# Altium project Double_H_Bridge_v1.0.PrjPCB
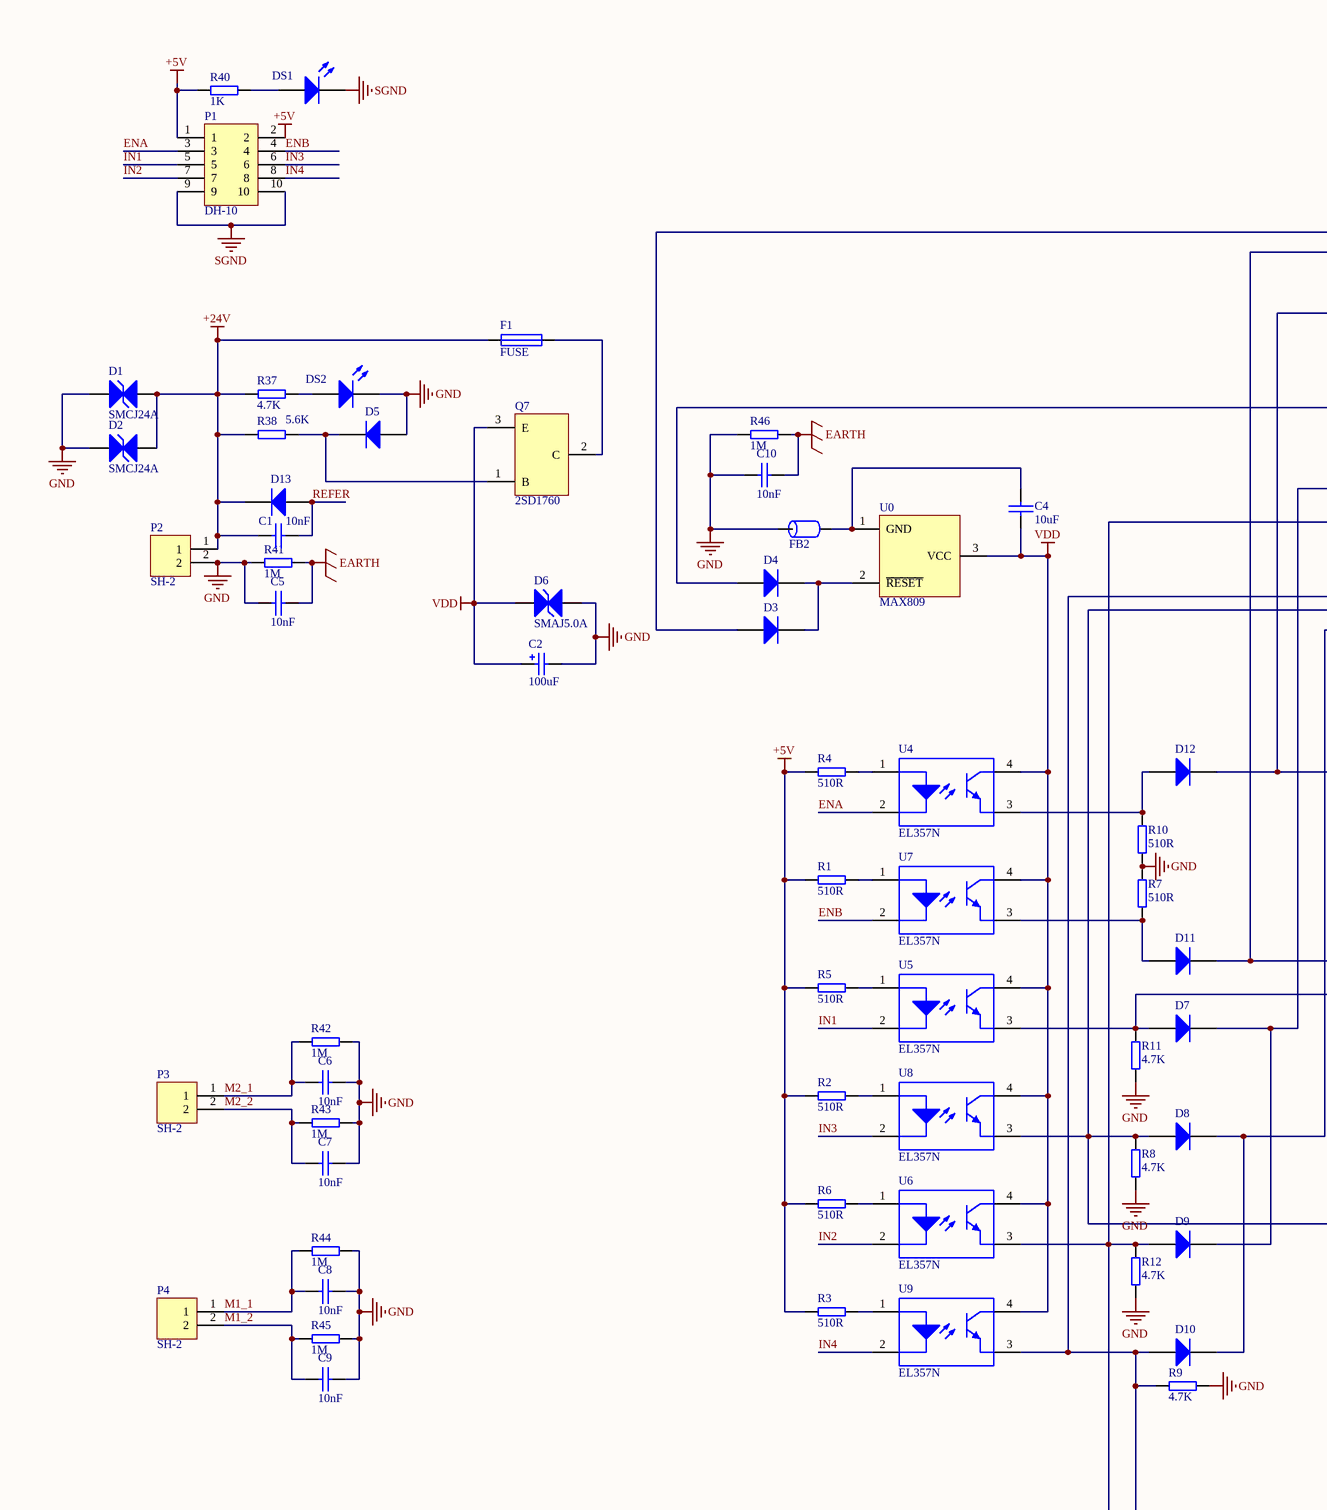
[diagram p0: Double_H_Bridge_v1.0.SchDoc, left]
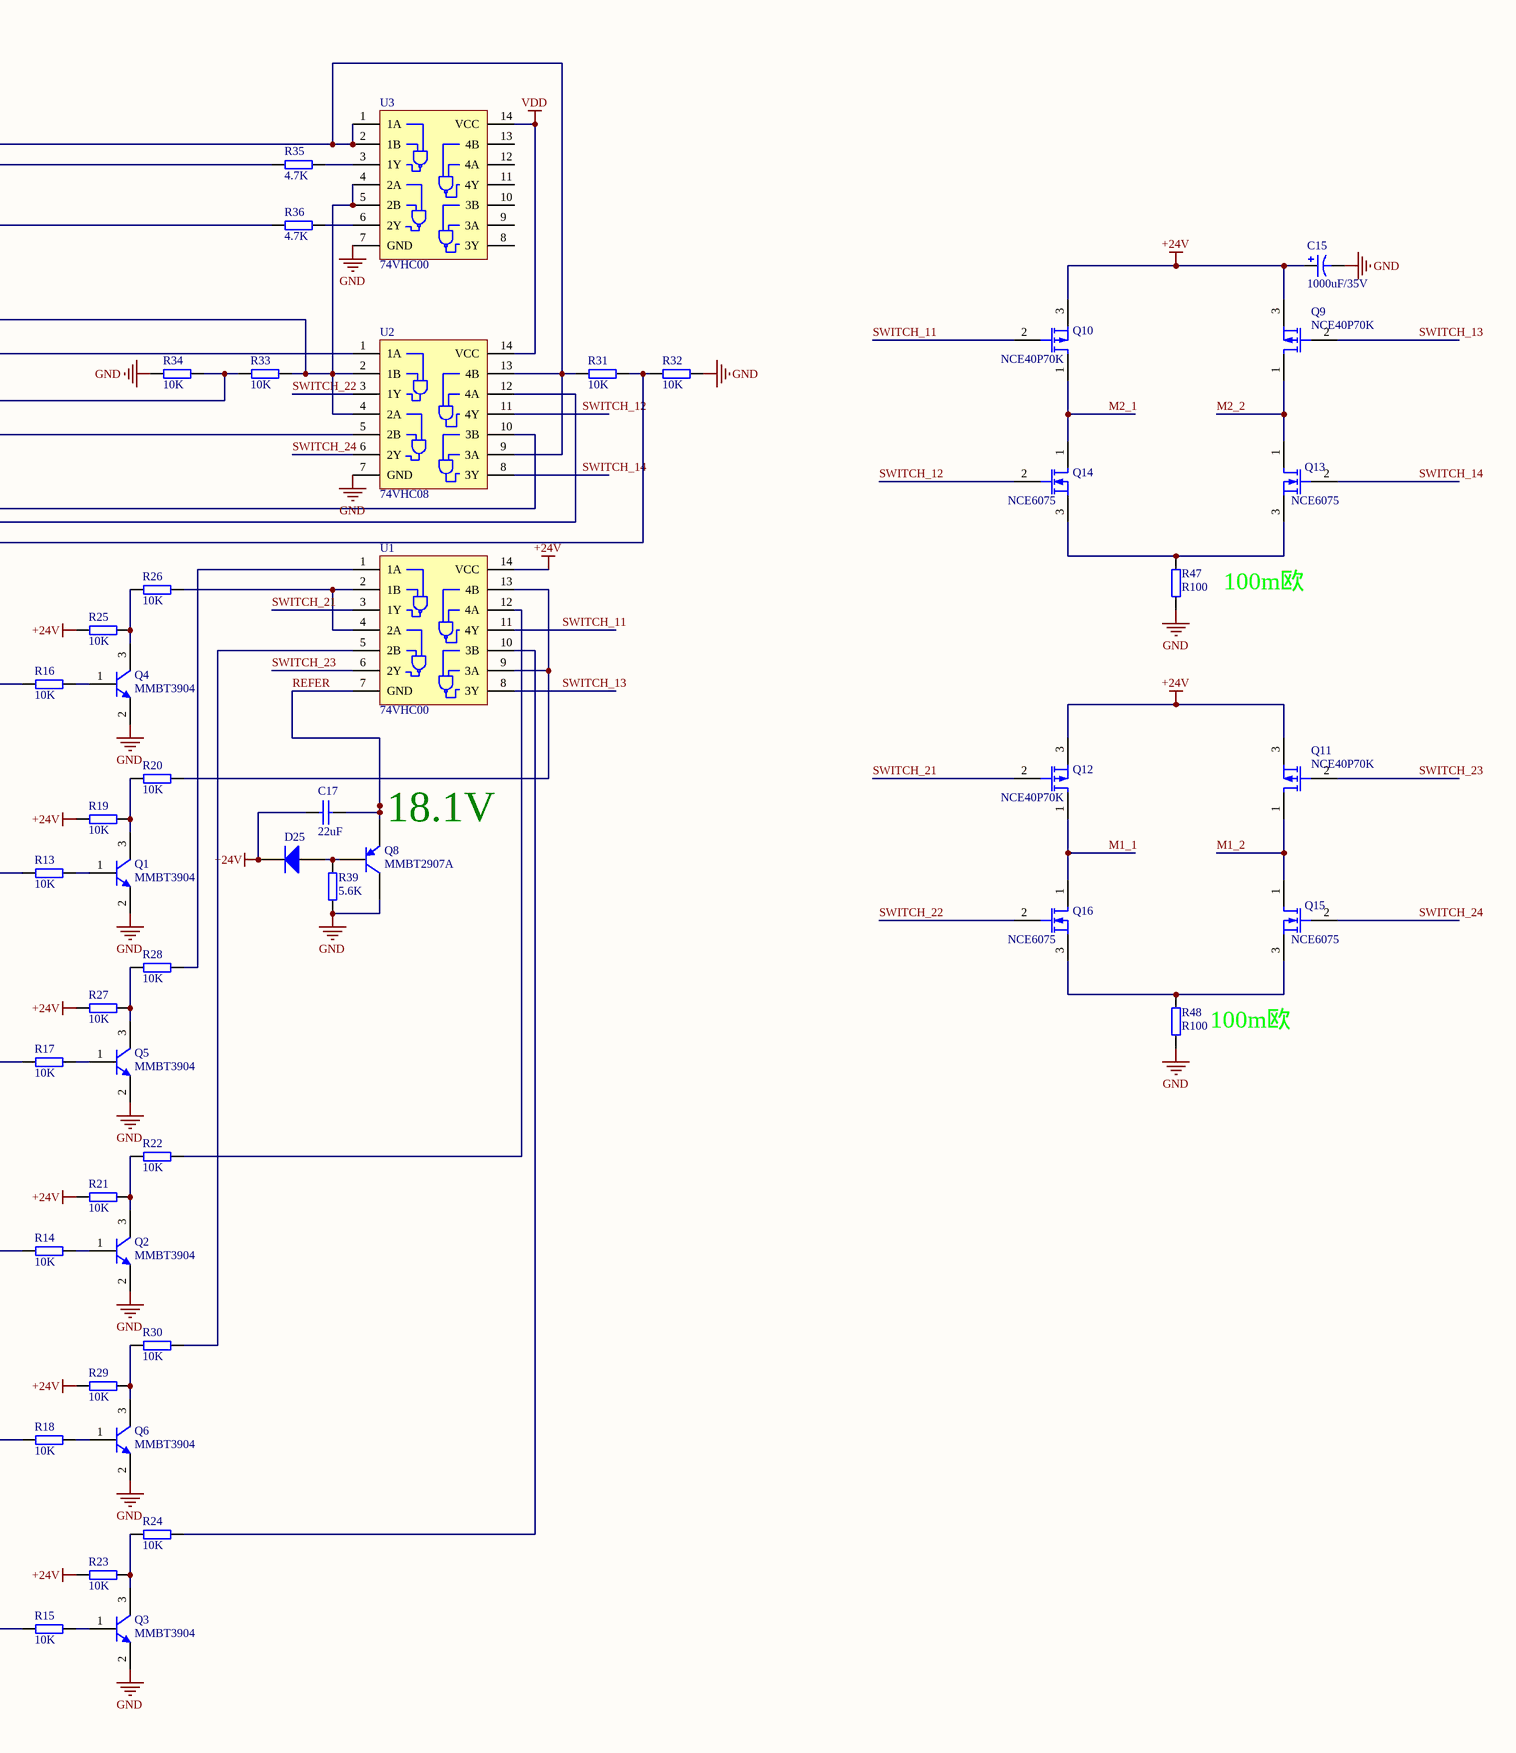
[diagram p1: Double_H_Bridge_v1.0.SchDoc, right]
1 sheet, 107 parts. Net scope: global (net labels, ports and power ports of the same name join across sheets).
Board file: Double_H_Bridge_v1.0.PcbDoc

## Sheet Double_H_Bridge_v1.0.SchDoc
size A2

### Parts
C1  10nF  [0603]
C2  100uF  [CA6032-C]
C4  10uF  [0805]
C5  10nF  [0603]
C6  10nF  [0603]
C7  10nF  [0603]
C8  10nF  [0603]
C9  10nF  [0603]
C10  10nF  [0603]
C15  1000uF/35V  [CAP-5mm]
C17  22uF  [0805]
D1  SMCJ24A  [DO-214AA/SMB]
D2  SMCJ24A  [DO-214AA/SMB]
D3  1N4148  [DIDODE_LL-34]  (value not drawn)
D4  1N4148  [DIDODE_LL-34]  (value not drawn)
D5  1N4148  [DIDODE_LL-34]  (value not drawn)
D6  SMAJ5.0A  [Diode_TP2]
D7  1N4148  [DIDODE_LL-34]  (value not drawn)
D8  1N4148  [DIDODE_LL-34]  (value not drawn)
D9  1N4148  [DIDODE_LL-34]  (value not drawn)
D10  1N4148  [DIDODE_LL-34]  (value not drawn)
D11  1N4148  [DIDODE_LL-34]  (value not drawn)
D12  1N4148  [DIDODE_LL-34]  (value not drawn)
D13  1N4148  [DIDODE_LL-34]  (value not drawn)
D25  1N4148  [DIDODE_LL-34]  (value not drawn)
DS1  GREEN  [LED]  (value not drawn)
DS2  GREEN  [LED]  (value not drawn)
F1  FUSE  [1206]
FB2  FERRITE  [0805]  (value not drawn)
P1  DH-10  [DH2.54-10]
P2  SH-2  [J508-2(1)]
P3  SH-2  [J508-2(1)]
P4  SH-2  [J508-2(1)]
Q1  MMBT3904  [SOT-23]
Q2  MMBT3904  [SOT-23]
Q3  MMBT3904  [SOT-23]
Q4  MMBT3904  [SOT-23]
Q5  MMBT3904  [SOT-23]
Q6  MMBT3904  [SOT-23]
Q7  2SD1760  [TO-252-2L]
Q8  MMBT2907A  [901X_SOT-23]
Q9  NCE40P70K  [TO-252]
Q10  NCE40P70K  [TO-252]
Q11  NCE40P70K  [TO-252]
Q12  NCE40P70K  [TO-252]
Q13  NCE6075  [TO-252]
Q14  NCE6075  [TO-252]
Q15  NCE6075  [TO-252]
Q16  NCE6075  [TO-252]
R1  510R  [0603]
R2  510R  [0603]
R3  510R  [0603]
R4  510R  [0603]
R5  510R  [0603]
R6  510R  [0603]
R7  510R  [0603]
R8  4.7K  [0603]
R9  4.7K  [0603]
R10  510R  [0603]
R11  4.7K  [0603]
R12  4.7K  [0603]
R13  10K  [0603]
R14  10K  [0603]
R15  10K  [0603]
R16  10K  [0603]
R17  10K  [0603]
R18  10K  [0603]
R19  10K  [0603]
R20  10K  [0603]
R21  10K  [0603]
R22  10K  [0603]
R23  10K  [0603]
R24  10K  [0603]
R25  10K  [0603]
R26  10K  [0603]
R27  10K  [0603]
R28  10K  [0603]
R29  10K  [0603]
R30  10K  [0603]
R31  10K  [0603]
R32  10K  [0603]
R33  10K  [0603]
R34  10K  [0603]
R35  4.7K  [0603]
R36  4.7K  [0603]
R37  4.7K  [0603]
R38  5.6K  [0603]
R39  5.6K  [0603]
R40  1K  [0603]
R41  1M  [0603]
R42  1M  [0603]
R43  1M  [0603]
R44  1M  [0603]
R45  1M  [0603]
R46  1M  [0603]
R47  R100  [1812]
R48  R100  [1812]
U0  MAX809  [SOT-23]
U1  74VHC00  [SO-14]
U2  74VHC08  [SO-14]
U3  74VHC00  [SO-14]
U4  EL357N  [EL357N]
U5  EL357N  [EL357N]
U6  EL357N  [EL357N]
U7  EL357N  [EL357N]
U8  EL357N  [EL357N]
U9  EL357N  [EL357N]

### Nets
+5V: P1.1 P1.2 R1.1 R2.1 R3.1 R4.1 R5.1 R6.1 R40.1
+24V: C1.1 C15.1 C17.2 D1.1(A) D2.1(A) D13.2(K) D25.2(K) F1.2 P2.1 Q9.3(S) Q10.3(S) Q11.3(S) Q12.3(S) R19.1 R21.1 R23.1 R25.1 R27.1 R29.1 R37.1 R38.1 U1.14(VCC)
EARTH: C5.1 C10.1 R41.2 R46.2
GND: C2.2 C5.2 C6.1 C7.1 C8.1 C9.1 C10.2 C15.2 D1.2(K) D2.2(K) D5.1(A) D6.1(A) DS2.2(K) FB2.2 P2.2 Q1.2(E) Q2.2(E) Q3.2(E) Q4.2(E) Q5.2(E) Q6.2(E) Q8.1(C) R7.2 R8.1 R9.2 R10.1 R11.1 R12.1 R32.2 R34.1 R39.1 R41.1 R42.2 R43.2 R44.2 R45.2 R46.1 R47.1 R48.1 U2.7(GND) U3.7(GND)
SGND: DS1.2(K) P1.9 P1.10
VDD: C2.1 C4.1 D6.2(K) Q7.3(E) U0.3(VCC) U2.14(VCC) U3.14(VCC) U4.4(C) U5.4(C) U6.4(C) U7.4(C) U8.4(C) U9.4(C)
ENA: P1.3 U4.2(Vin-)
ENB: P1.4 U7.2(Vin-)
IN1: P1.5 U5.2(Vin-)
IN2: P1.7 U6.2(Vin-)
IN3: P1.6 U8.2(Vin-)
IN4: P1.8 U9.2(Vin-)
M1_1: C8.2 P4.1 Q12.1(D) Q16.1(D) R44.1
M1_2: C9.2 P4.2 Q11.1(D) Q15.1(D) R45.1
M2_1: C6.2 P3.1 Q10.1(D) Q14.1(D) R42.1
M2_2: C7.2 P3.2 Q9.1(D) Q13.1(D) R43.1
REFER: C1.2 C17.1 D13.1(A) Q8.3(E) U1.7(GND)
SWITCH_11: Q10.2(G) U1.11(4Y)
SWITCH_12: Q14.2(G) U2.11(4Y)
SWITCH_13: Q9.2(G) U1.8(3Y)
SWITCH_14: Q13.2(G) U2.8(3Y)
SWITCH_21: Q12.2(G) U1.3(1Y)
SWITCH_22: Q16.2(G) U2.3(1Y)
SWITCH_23: Q11.2(G) U1.6(2Y)
SWITCH_24: Q15.2(G) U2.6(2Y)
NetC4_2: C4.2 FB2.1 U0.1(GND)
NetD3_1: D3.1(A) R31.1 U2.9(3A) U2.13(4B) U3.1(1A) U3.2(1B)
NetD3_2: D3.2(K) D4.2(K) U0.2(~{RESET})
NetD4_1: D4.1(A) R33.2 U2.2(1B) U2.4(2A) U3.4(2A) U3.5(2B)
NetD5_2: D5.2(K) Q7.1(B) R38.2
NetD7_1: D7.1(A) R11.2 R17.1 U2.1(1A) U5.3(E)
NetD7_2: D7.2(K) D9.2(K) R33.1 R34.2
NetD8_1: D8.1(A) R8.2 R14.1 U2.12(4A) U8.3(E)
NetD8_2: D8.2(K) D10.2(K) R31.2 R32.1
NetD9_1: D9.1(A) R12.2 R18.1 U2.5(2B) U6.3(E)
NetD10_1: D10.1(A) R9.1 R15.1 U2.10(3B) U9.3(E)
NetD11_1: D11.1(A) R7.1 U7.3(E)
NetD11_2: D11.2(K) R13.1 R35.1
NetD12_1: D12.1(A) R10.2 U4.3(E)
NetD12_2: D12.2(K) R16.1 R36.1
NetD25_1: D25.1(A) Q8.2(B) R39.2
NetDS1_1: DS1.1(A) R40.2
NetDS2_1: DS2.1(A) R37.2
NetF1_1: F1.1 Q7.2(C)
NetQ1_1: Q1.1(B) R13.2
NetQ1_3: Q1.3(C) R19.2 R20.1
NetQ2_1: Q2.1(B) R14.2
NetQ2_3: Q2.3(C) R21.2 R22.1
NetQ3_1: Q3.1(B) R15.2
NetQ3_3: Q3.3(C) R23.2 R24.1
NetQ4_1: Q4.1(B) R16.2
NetQ4_3: Q4.3(C) R25.2 R26.1
NetQ5_1: Q5.1(B) R17.2
NetQ5_3: Q5.3(C) R27.2 R28.1
NetQ6_1: Q6.1(B) R18.2
NetQ6_3: Q6.3(C) R29.2 R30.1
NetQ13_3: Q13.3(S) Q14.3(S) R47.2
NetQ15_3: Q15.3(S) Q16.3(S) R48.2
NetR1_2: R1.2 U7.1(Vin+)
NetR2_2: R2.2 U8.1(Vin+)
NetR3_2: R3.2 U9.1(Vin+)
NetR4_2: R4.2 U4.1(Vin+)
NetR5_2: R5.2 U5.1(Vin+)
NetR6_2: R6.2 U6.1(Vin+)
NetR20_2: R20.2 U1.9(3A) U1.13(4B)
NetR22_2: R22.2 U1.12(4A)
NetR24_2: R24.2 U1.10(3B)
NetR26_2: R26.2 U1.2(1B) U1.4(2A)
NetR28_2: R28.2 U1.1(1A)
NetR30_2: R30.2 U1.5(2B)
NetR35_2: R35.2 U3.3(1Y)
NetR36_2: R36.2 U3.6(2Y)

Not connected (* = marked no-connect by the designer): U3 8(3Y) 9(3A) 10(3B) 11(4Y) 12(4A) 13(4B)

### Notes on the sheet
- 100m欧
- (near Q8) 18.1V
- (near R48) 100m欧

### Library data of the parts
C1 C4-C10 C17 = CAP: 电容
C2 = CapAEC*4
C15 = Cap Pol1: Polarized Capacitor (Radial); Published: 8-Jun-2000; LatestRevisionDate: 17-Jul-2002; LatestRevisionNote: Re-released for DXP Platform.; PackageReference: RB7.6-15; Publisher: Altium Limited
D1 D2 D6 = TVS: Published: 8-Jun-2000; LatestRevisionDate: 17-Jul-2002; LatestRevisionNote: Re-released for DXP Platform.; PackageReference: DIODE-0.7; Publisher: Altium Limited
D3-D5 D7-D13 D25 = Diode: Default Diode; Published: 8-Jun-2000; LatestRevisionDate: 17-Jul-2002; LatestRevisionNote: Re-released for DXP Platform.; PackageVersion: Sep-1996; PackageReference: SMC; Publisher: Altium Limited; Code_JEDEC: DO-214-AB
DS1 DS2 = LED2: Typical RED, GREEN, YELLOW, AMBER GaAs LED; Published: 8-Jun-2000; Revision: July-2002: Re-released for DXP Platform.; Publisher: Altium Limited
F1 = FUSE: 保险丝
Q1-Q6 = S8050
Q8 = PNP
Q9-Q12 = MOSFET-P: P-Channel MOSFET; Published: 8-Jun-2000; LatestRevisionDate: 17-Jul-2002; LatestRevisionNote: Re-released for DXP Platform.; PackageVersion: 1995/1996; PackageReference: E3; Publisher: Altium Limited
Q13-Q16 = MOSFET-N: N-Channel MOSFET; Published: 8-Jun-2000; LatestRevisionDate: 17-Jul-2002; LatestRevisionNote: Re-released for DXP Platform.; PackageVersion: 1995/1996; PackageReference: E3; Publisher: Altium Limited
R1-R48 = RES: 电阻
U2 = 74HC08
U4-U9 = TLP521